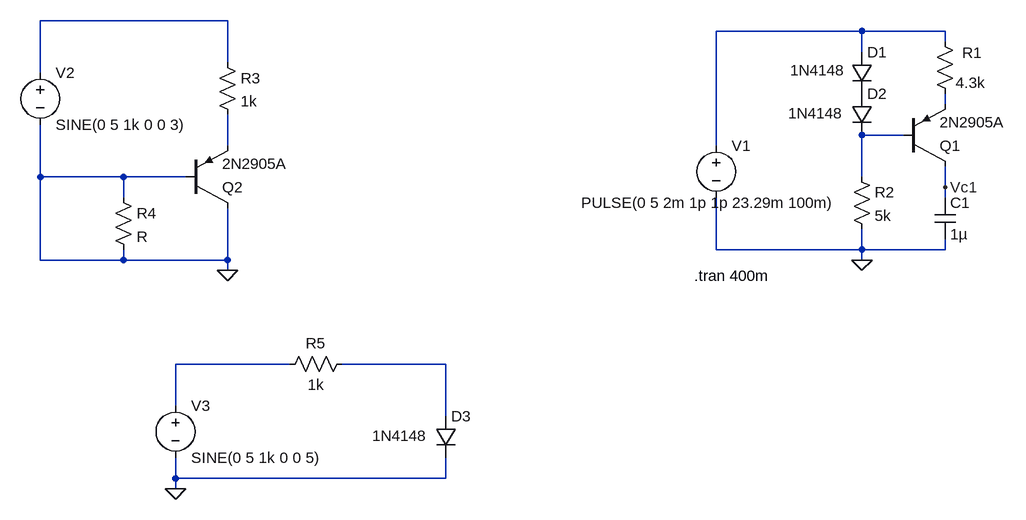
[diagram p0: schematic projet_5.asc]
projet_5.asc, the LTspice schematic file:
Version 4
SHEET 1 880 680
WIRE -784 -96 -1072 -96
WIRE 192 -80 -32 -80
WIRE 320 -80 192 -80
WIRE 320 -64 320 -80
WIRE 192 -48 192 -80
WIRE -784 -32 -784 -96
WIRE -1072 -16 -1072 -96
WIRE 320 32 320 16
WIRE 256 80 192 80
WIRE -784 96 -784 48
WIRE -32 96 -32 -80
WIRE -1072 144 -1072 64
WIRE -944 144 -1072 144
WIRE -848 144 -944 144
WIRE 192 144 192 80
WIRE 320 160 320 128
WIRE -944 176 -944 144
WIRE 320 176 320 160
WIRE -32 256 -32 176
WIRE 192 256 192 224
WIRE 192 256 -32 256
WIRE 320 256 320 240
WIRE 320 256 192 256
WIRE -1072 272 -1072 144
WIRE -944 272 -944 256
WIRE -944 272 -1072 272
WIRE -784 272 -784 192
WIRE -784 272 -944 272
WIRE 192 272 192 256
WIRE -784 288 -784 272
WIRE -688 432 -864 432
WIRE -448 432 -608 432
WIRE -864 496 -864 432
WIRE -448 512 -448 432
WIRE -864 608 -864 576
WIRE -448 608 -448 576
WIRE -448 608 -864 608
WIRE -864 624 -864 608
FLAG 192 272 0
FLAG 320 160 Vc1
FLAG -784 288 0
FLAG -864 624 0
SYMBOL voltage -32 80 R0
WINDOW 3 -208 104 Left 2
WINDOW 123 0 0 Left 0
WINDOW 39 0 0 Left 0
SYMATTR InstName V1
SYMATTR Value PULSE(0 5 2m 1p 1p 23.29m 100m)
SYMBOL diode 176 -48 R0
WINDOW 3 -94 28 Left 2
SYMATTR InstName D1
SYMATTR Value 1N4148
SYMBOL diode 176 16 R0
WINDOW 3 -97 30 Left 2
SYMATTR InstName D2
SYMATTR Value 1N4148
SYMBOL res 176 128 R0
SYMATTR InstName R2
SYMATTR Value 5k
SYMBOL res 304 -80 R0
WINDOW 0 42 33 Left 2
WINDOW 3 32 79 Left 2
SYMATTR InstName R1
SYMATTR Value 4.3k
SYMBOL cap 304 176 R0
SYMATTR InstName C1
SYMATTR Value 1µ
SYMBOL pnp 256 128 M180
SYMATTR InstName Q1
SYMATTR Value 2N2905A
SYMBOL diode -464 512 R0
WINDOW 3 -97 30 Left 2
SYMATTR InstName D3
SYMATTR Value 1N4148
SYMBOL voltage -1072 -32 R0
WINDOW 123 0 0 Left 0
WINDOW 39 0 0 Left 0
SYMATTR InstName V2
SYMATTR Value SINE(0 5 1k 0 0 3)
SYMBOL voltage -864 480 R0
WINDOW 123 0 0 Left 0
WINDOW 39 0 0 Left 0
SYMATTR InstName V3
SYMATTR Value SINE(0 5 1k 0 0 5)
SYMBOL pnp -848 192 M180
SYMATTR InstName Q2
SYMATTR Value 2N2905A
SYMBOL res -800 -48 R0
SYMATTR InstName R3
SYMATTR Value 1k
SYMBOL res -960 160 R0
SYMATTR InstName R4
SYMBOL res -592 416 R90
WINDOW 0 0 56 VBottom 2
WINDOW 3 32 56 VTop 2
SYMATTR InstName R5
SYMATTR Value 1k
TEXT -66 296 Left 2 !.tran 400m

The netlist it stands for:
* projet_5.asc
V1 N002 0 PULSE(0 5 2m 1p 1p 23.29m 100m)
D1 N002 P001 1N4148
D2 P001 N004 1N4148
R2 N004 0 5k
R1 N002 N003 4.3k
C1 Vc1 0 1µ
Q1 Vc1 N004 N003 0 2N2905A
D3 N007 0 1N4148
V2 N001 0 SINE(0 5 1k 0 0 3)
V3 N006 0 SINE(0 5 1k 0 0 5)
Q2 0 0 N005 0 2N2905A
R3 N001 N005 1k
R4 0 0 R
R5 N007 N006 1k
.model D D
.lib standard.dio
.model NPN NPN
.model PNP PNP
.lib standard.bjt
.tran 400m
.backanno
.end